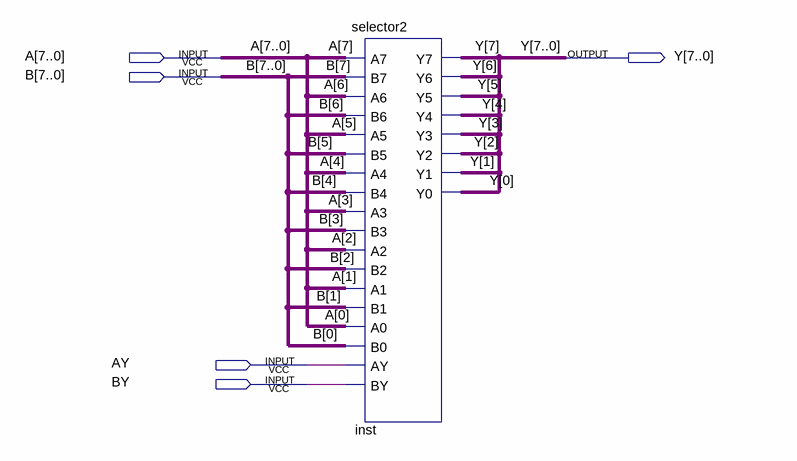
[diagram p0: schematic sheet]
// Quartus schematic selector2_bus.bdf as structural Verilog: 1 symbols, 5 pins
module selector2_bus (
  input  [7:0] A,
  input  [7:0] B,
  input  AY,
  input  BY,
  output [7:0] Y
);

  selector2 inst (
    .A7(A[7]), .B7(B[7]), .A6(A[6]), .B6(B[6]), .A5(A[5]), .B5(B[5]), .A4(A[4]), .B4(B[4]), .A3(A[3]),
    .B3(B[3]), .A2(A[2]), .B2(B[2]), .A1(A[1]), .B1(B[1]), .A0(A[0]), .B0(B[0]), .AY(AY), .BY(BY), .Y7(Y[7]),
    .Y6(Y[6]), .Y5(Y[5]), .Y4(Y[4]), .Y3(Y[3]), .Y2(Y[2]), .Y1(Y[1]), .Y0(Y[0]));
endmodule
